# Altium schematic sheet TPS54260.SchDoc: IN, SWITCH, OUT
size 420 x 297 mm; Revision: 1.0; SheetNumber: 3
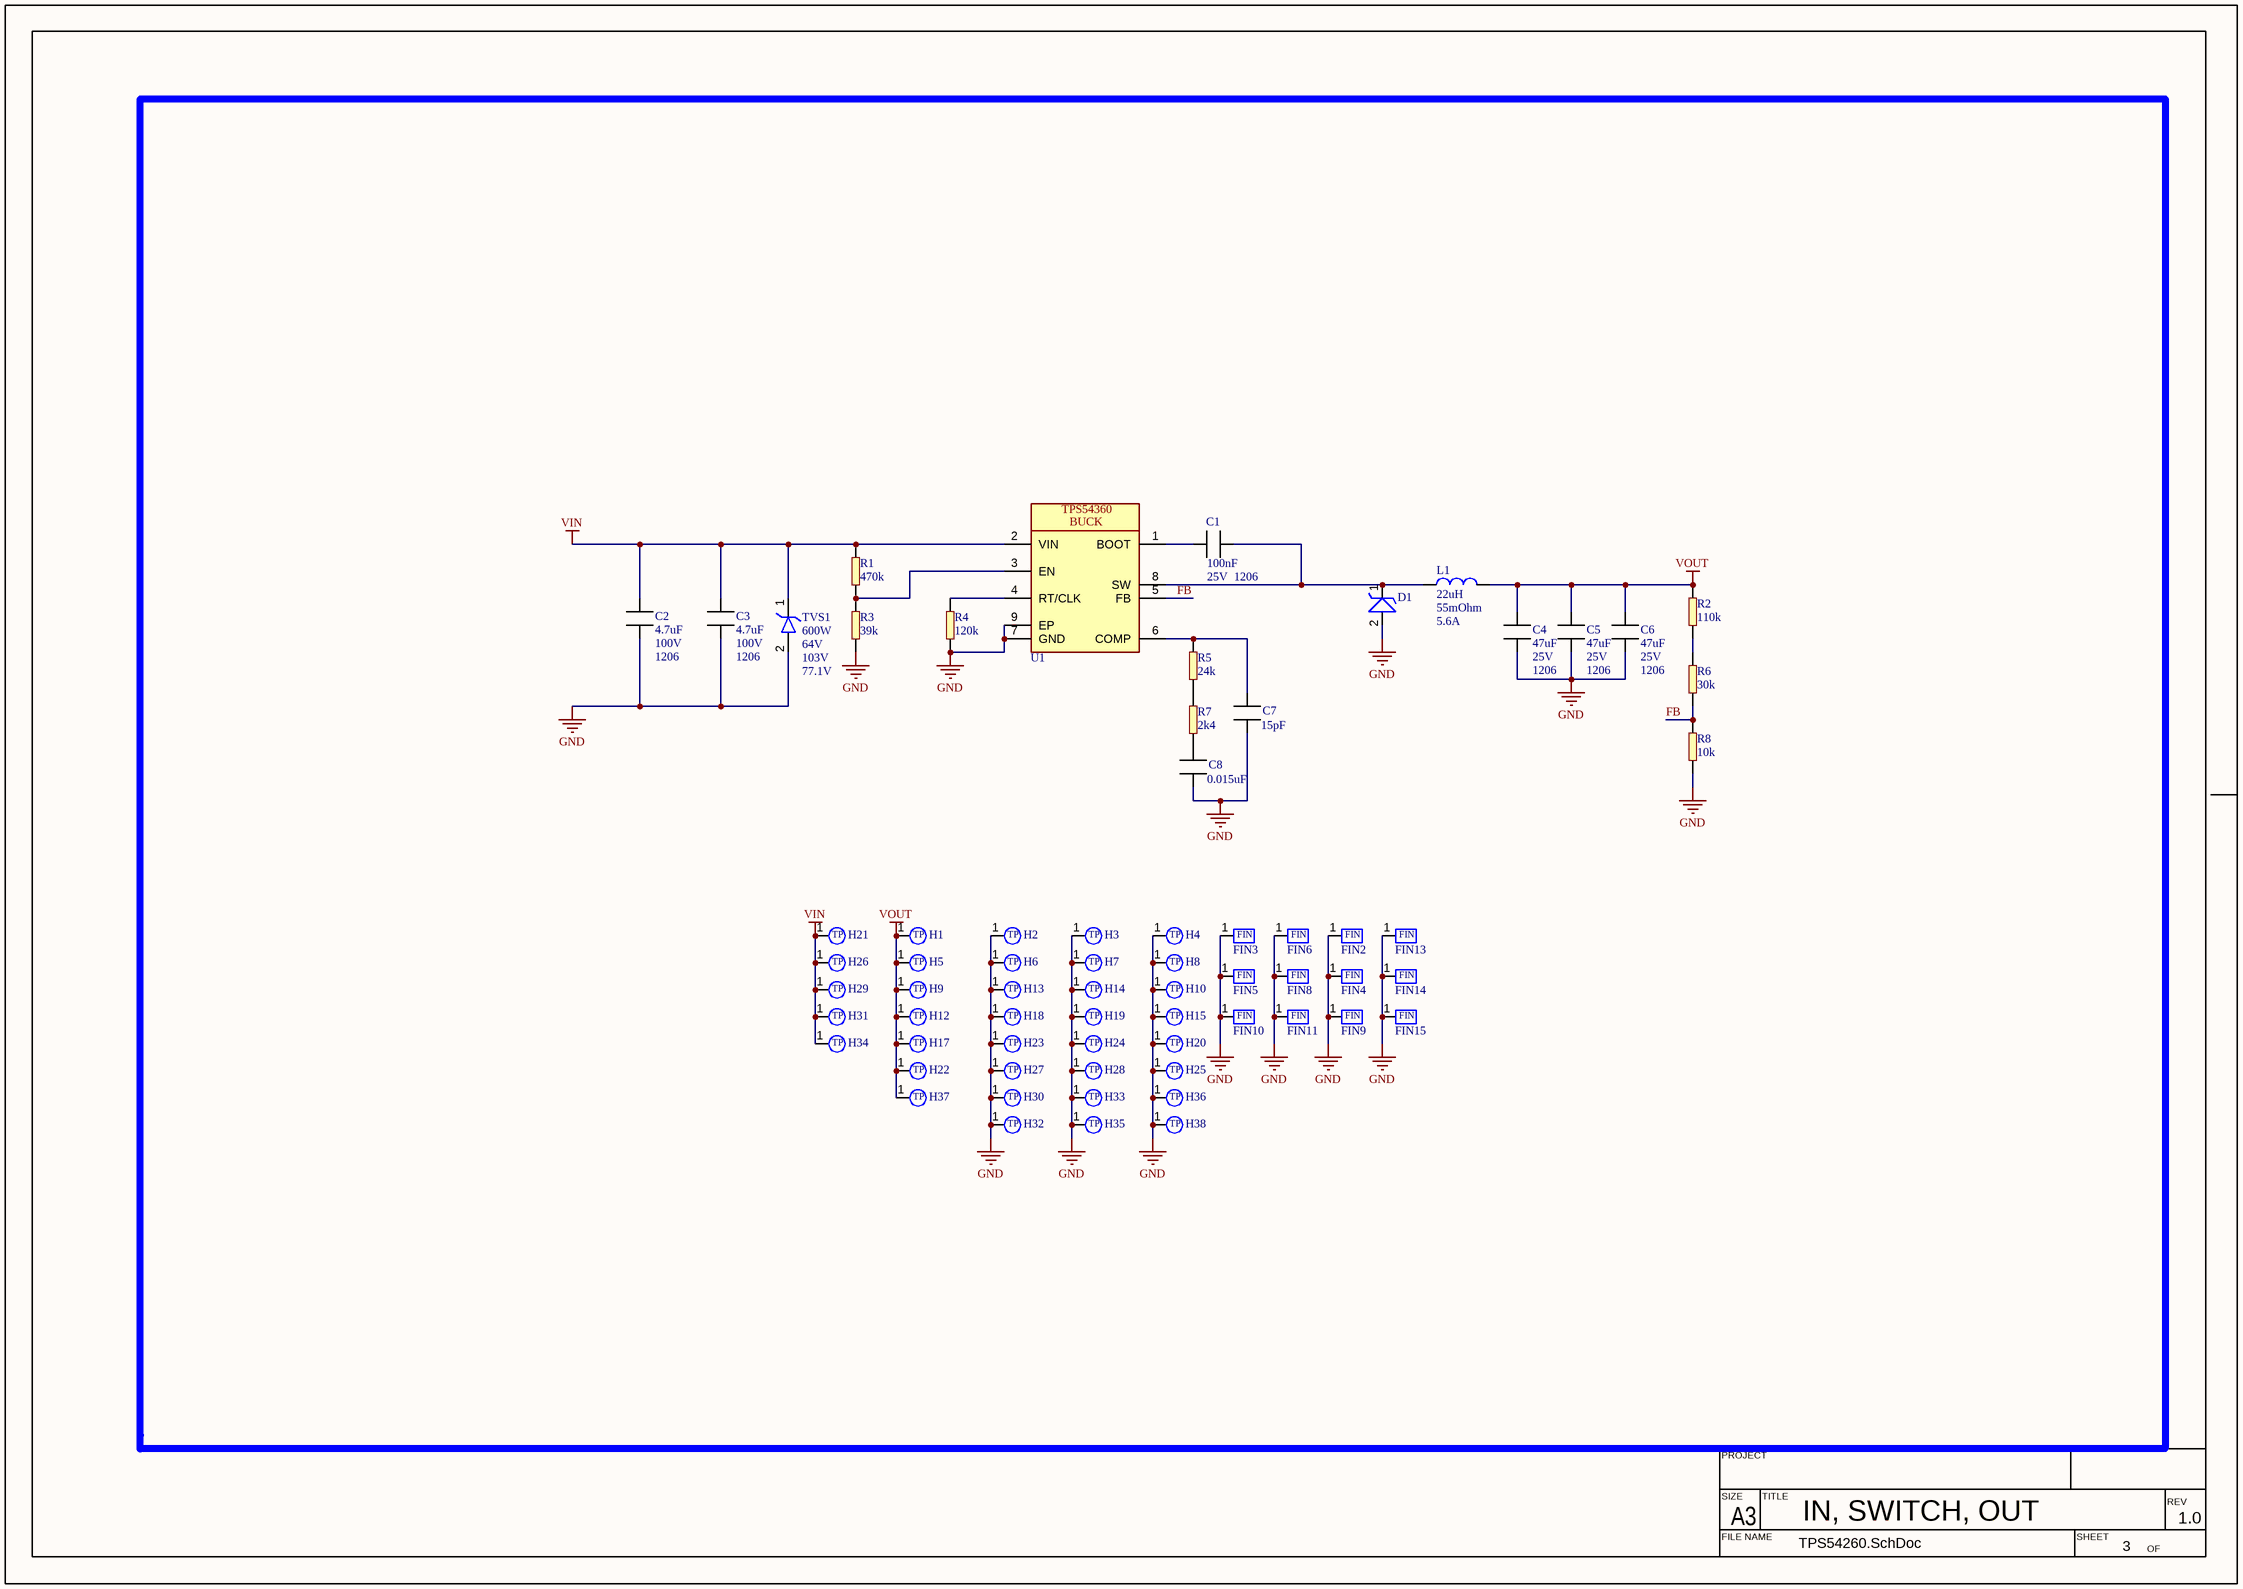
[diagram p0: TPS54260.SchDoc]

## Parts
C1  value 100nF  Voltage: 25V  Package: 1206  [CAP1206]  (hidden comment: MLCC_1206)
C2  value 4.7uF  Voltage: 100V  Package: 1206  [CAP1206]  (hidden comment: MLCC_1206)
C3  value 4.7uF  Voltage: 100V  Package: 1206  [CAP1206]  (hidden comment: MLCC_1206)
C4  value 47uF  Voltage: 25V  Package: 1206  [CAP1206]  (hidden comment: MLCC_1206)
C5  value 47uF  Voltage: 25V  Package: 1206  [CAP1206]  (hidden comment: MLCC_1206)
C6  value 47uF  Voltage: 25V  Package: 1206  [CAP1206]  (hidden comment: MLCC_1206)
C7  value 15pF  [CAPC1608X10N]  (hidden comment: ERP_102-1)
C8  value 0.015uF  [CAPC1608X10N]  (hidden comment: ERP_102-1)
D1  CDBB_5XX_HF  [SMB(DO214AA)]  (value not drawn)
FIN2  FIN_5X1  [FIN_5X1]  (value not drawn)  (no BOM)
FIN3  FIN_5X1  [FIN_5X1]  (value not drawn)  (no BOM)
FIN4  FIN_5X1  [FIN_5X1]  (value not drawn)  (no BOM)
FIN5  FIN_5X1  [FIN_5X1]  (value not drawn)  (no BOM)
FIN6  FIN_5X1  [FIN_5X1]  (value not drawn)  (no BOM)
FIN8  FIN_5X1  [FIN_5X1]  (value not drawn)  (no BOM)
FIN9  FIN_5X1  [FIN_5X1]  (value not drawn)  (no BOM)
FIN10  FIN_5X1  [FIN_5X1]  (value not drawn)  (no BOM)
FIN11  FIN_5X1  [FIN_5X1]  (value not drawn)  (no BOM)
FIN13  FIN_5X1  [FIN_5X1]  (value not drawn)  (no BOM)
FIN14  FIN_5X1  [FIN_5X1]  (value not drawn)  (no BOM)
FIN15  FIN_5X1  [FIN_5X1]  (value not drawn)  (no BOM)
H1  Castalated_Hole_1MM  [CS_1MM]  (value not drawn)  (no BOM)
H2  Castalated_Hole_1MM  [CS_1MM]  (value not drawn)  (no BOM)
H3  Castalated_Hole_1MM  [CS_1MM]  (value not drawn)  (no BOM)
H4  Castalated_Hole_1MM  [CS_1MM]  (value not drawn)  (no BOM)
H5  Castalated_Hole_1MM  [CS_1MM]  (value not drawn)  (no BOM)
H6  Castalated_Hole_1MM  [CS_1MM]  (value not drawn)  (no BOM)
H7  Castalated_Hole_1MM  [CS_1MM]  (value not drawn)  (no BOM)
H8  Castalated_Hole_1MM  [CS_1MM]  (value not drawn)  (no BOM)
H9  Castalated_Hole_1MM  [CS_1MM]  (value not drawn)  (no BOM)
H10  Castalated_Hole_1MM  [CS_1MM]  (value not drawn)  (no BOM)
H12  Castalated_Hole_1MM  [CS_1MM]  (value not drawn)  (no BOM)
H13  Castalated_Hole_1MM  [CS_1MM]  (value not drawn)  (no BOM)
H14  Castalated_Hole_1MM  [CS_1MM]  (value not drawn)  (no BOM)
H15  Castalated_Hole_1MM  [CS_1MM]  (value not drawn)  (no BOM)
H17  Castalated_Hole_1MM  [CS_1MM]  (value not drawn)  (no BOM)
H18  Castalated_Hole_1MM  [CS_1MM]  (value not drawn)  (no BOM)
H19  Castalated_Hole_1MM  [CS_1MM]  (value not drawn)  (no BOM)
H20  Castalated_Hole_1MM  [CS_1MM]  (value not drawn)  (no BOM)
H21  Castalated_Hole_1MM  [CS_1MM]  (value not drawn)  (no BOM)
H22  Castalated_Hole_1MM  [CS_1MM]  (value not drawn)  (no BOM)
H23  Castalated_Hole_1MM  [CS_1MM]  (value not drawn)  (no BOM)
H24  Castalated_Hole_1MM  [CS_1MM]  (value not drawn)  (no BOM)
H25  Castalated_Hole_1MM  [CS_1MM]  (value not drawn)  (no BOM)
H26  Castalated_Hole_1MM  [CS_1MM]  (value not drawn)  (no BOM)
H27  Castalated_Hole_1MM  [CS_1MM]  (value not drawn)  (no BOM)
H28  Castalated_Hole_1MM  [CS_1MM]  (value not drawn)  (no BOM)
H29  Castalated_Hole_1MM  [CS_1MM]  (value not drawn)  (no BOM)
H30  Castalated_Hole_1MM  [CS_1MM]  (value not drawn)  (no BOM)
H31  Castalated_Hole_1MM  [CS_1MM]  (value not drawn)  (no BOM)
H32  Castalated_Hole_1MM  [CS_1MM]  (value not drawn)  (no BOM)
H33  Castalated_Hole_1MM  [CS_1MM]  (value not drawn)  (no BOM)
H34  Castalated_Hole_1MM  [CS_1MM]  (value not drawn)  (no BOM)
H35  Castalated_Hole_1MM  [CS_1MM]  (value not drawn)  (no BOM)
H36  Castalated_Hole_1MM  [CS_1MM]  (value not drawn)  (no BOM)
H37  Castalated_Hole_1MM  [CS_1MM]  (value not drawn)  (no BOM)
H38  Castalated_Hole_1MM  [CS_1MM]  (value not drawn)  (no BOM)
L1  value 22uH  DCR: 55mOhm  ISAT: 5.6A  [SRP6060FA]  (hidden comment: SRP6060FA)
R1  value 470k  [RES_0603]  (hidden comment: ERP_101-1)
R2  value 110k  [RES_0603]  (hidden comment: ERP_101-1)
R3  value 39k  [RES_0603]  (hidden comment: ERP_101-1)
R4  value 120k  [RES_0603]  (hidden comment: ERP_101-1)
R5  value 24k  [RES_0603]  (hidden comment: ERP_101-1)
R6  value 30k  [RES_0603]  (hidden comment: ERP_101-1)
R7  value 2k4  [RES_0603]  (hidden comment: ERP_101-1)
R8  value 10k  [RES_0603]  (hidden comment: ERP_101-1)
TVS1  PD: 600W  VRV: 64V  VCL: 103V  VBR: 77.1V  [SMBJ58A]  (hidden comment: SMBJ58A)
U1  TPS54360DDAR  [TPS54360DDAR]  (value not drawn)

## Nets
GND: C2.2 C3.2 C4.2 C5.2 C6.2 C7.2 C8.2 D1.2(A) FIN2.1 FIN3.1 FIN4.1 FIN5.1 FIN6.1 FIN8.1 FIN9.1 FIN10.1 FIN11.1 FIN13.1 FIN14.1 FIN15.1 H2.1 H3.1 H4.1 H6.1 H7.1 H8.1 H10.1 H13.1 H14.1 H15.1 H18.1 H19.1 H20.1 H23.1 H24.1 H25.1 H27.1 H28.1 H30.1 H32.1 H33.1 H35.1 H36.1 H38.1 R3.1 R4.1 R8.1 TVS1.2(A) U1.7(GND) U1.9(EP)
VIN: C2.1 C3.1 H21.1 H26.1 H29.1 H31.1 H34.1 R1.2 TVS1.1(K) U1.2(VIN)
VOUT: C4.1 C5.1 C6.1 H1.1 H5.1 H9.1 H12.1 H17.1 H22.1 H37.1 L1.2 R2.2
FB: R6.1 R8.2 U1.5(FB)
NetC1_1: C1.1 U1.1(BOOT)
NetC1_2: C1.2 D1.1(K) L1.1 U1.8(SW)
NetC7_1: C7.1 R5.2 U1.6(COMP)
NetC8_1: C8.1 R7.1
NetR1_1: R1.1 R3.2 U1.3(EN)
NetR2_1: R2.1 R6.2
NetR4_2: R4.2 U1.4(RT/CLK)
NetR5_1: R5.1 R7.2

## Notes on the sheet
- PROJECT
- SIZE
- FILE NAME
- A3
- TITLE
- SHEET
- OF
- REV
- (in symbol Castalated_Hole_1MM) TP
- (in symbol FIN_5X1) FIN
- (in symbol TPS54360DDAR) TPS54360; BUCK

## Library data of the parts
C1 = MLCC_1206: MLCC 1206 (3216 Metric); Manufacturer 1: *; Manufacturer Part Number 1: *
C2-C6 = MLCC_1206: MLCC 1206 (3216 Metric); Manufacturer 1: Murata Electronics; Manufacturer Part Number 1: GRM31CZ72A475KE11L
C7 C8 = MLCC_0603: Chip Capacitor, 2-Leads, Body 1.60x0.80mm, IPC Medium Density; Package: 0603; Manufacturer 1: *; Manufacturer Part Number 1: *
D1 = CDBB_5XX_HF: SMB(DO-214AA) DIODE HF 5A; Manufacturer Part Number 1: CDBB5100-HF; Manufacturer 1: Comchip; Package: SMB; Value: *
FIN2-FIN6 FIN8-FIN11 FIN13-FIN15 = FIN_5X1: FIN_5X1 Radiator
L1 = SRP6060FA: SRP6060FA Bourns 6.4 x 6.6 MM; Manufacturer Part Number 1: SRP6060FA-220M; Manufacturer 1: Coilcraft
R1-R8 = RES_0603: Package: 0603; Manufacturer 1: *; Manufacturer Part Number 1: *
TVS1 = SMBJ58A: TVS DIODE DO-214AA, SMB; Manufacturer Part Number 1: SMBJ64A; Manufacturer 1: *; Value: *
U1 = TPS54360DDAR: Buck, Split Rail Switching Regulator IC Positive Adjustable 0.8V 1 Output 3.5A 8-PowerSOIC (0.154", 3.90mm Width); Manufacturer 1: Texas Instruments; Value: *; Manufacturer Part Number 1: TPS54360DDAR